# Altium schematic sheet LASER.SchDoc
size A4
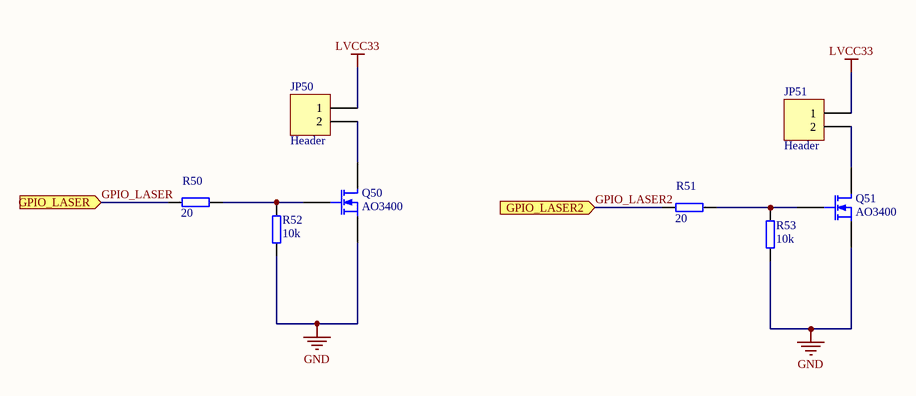
[diagram p0: LASER.SchDoc]

## Parts
JP50  Header  [LASERJACK]
JP51  Header  [LASERJACK]
Q50  AO3400  [SI2300]
Q51  AO3400  [SI2300]
R50  20  [R0402]
R51  20  [R0402]
R52  10k  [R0402]
R53  10k  [R0402]

## Ports
GPIO_LASER2 (in), GPIO_LASER (in)

## Nets
GND: Q50.3(S) Q51.3(S) R52.2 R53.2
LVCC33: JP50.1 JP51.1
GPIO_LASER: R50.2 ; port GPIO_LASER
GPIO_LASER2: R51.2 ; port GPIO_LASER2
NetJP50_2: JP50.2 Q50.1(D)
NetJP51_2: JP51.2 Q51.1(D)
NetQ50_2: Q50.2(G) R50.1 R52.1
NetQ51_2: Q51.2(G) R51.1 R53.1

## Library data of the parts
JP50 JP51 = Header 2: Header, 2-Pin; 封装|UNIQUEID: 插装; 元: 1.5mm接插件; 产地: *; 厂商: *; 大小: *; 封装类型|UNIQUEID: *; 资料名称|UNIQUEID: *; 价格: *
Q50 Q51 = MOSFET-N: N-Channel MOSFET; pin to pad: 1>3 2>1 3>2; ·: 贴片; 元件�: N-MOS; 产地: *; 厂商: *; 大小: *; 封装�: *; 型号: AO3400; 物料�: *
R50-R53 = RES1: Ô: 电阻; 价格: 0.01; ·: 贴片; 封装�: 0603
  R50 R51: 大小: 20
  R52 R53: 大小: 10k